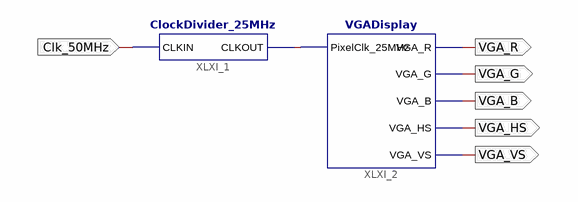
[diagram p0: schematic sheet 1]
// Xilinx ISE schematic VGADisplaySchema.sch (spartan3e) as structural Verilog: 2 symbols, 6 ports
module VGADisplaySchema (
  input  Clk_50MHz,
  output VGA_R,
  output VGA_G,
  output VGA_B,
  output VGA_HS,
  output VGA_VS
);

  wire XLXN_1;

  ClockDivider_25MHz XLXI_1 (.CLKIN(Clk_50MHz), .CLKOUT(XLXN_1));
  VGADisplay XLXI_2 (
    .PixelClk_25MHz(XLXN_1), .VGA_R(VGA_R), .VGA_G(VGA_G), .VGA_B(VGA_B), .VGA_HS(VGA_HS), .VGA_VS(VGA_VS));
endmodule
